# Altium project AMC_BOX_Panel.PrjPCB (part 1 of 2)
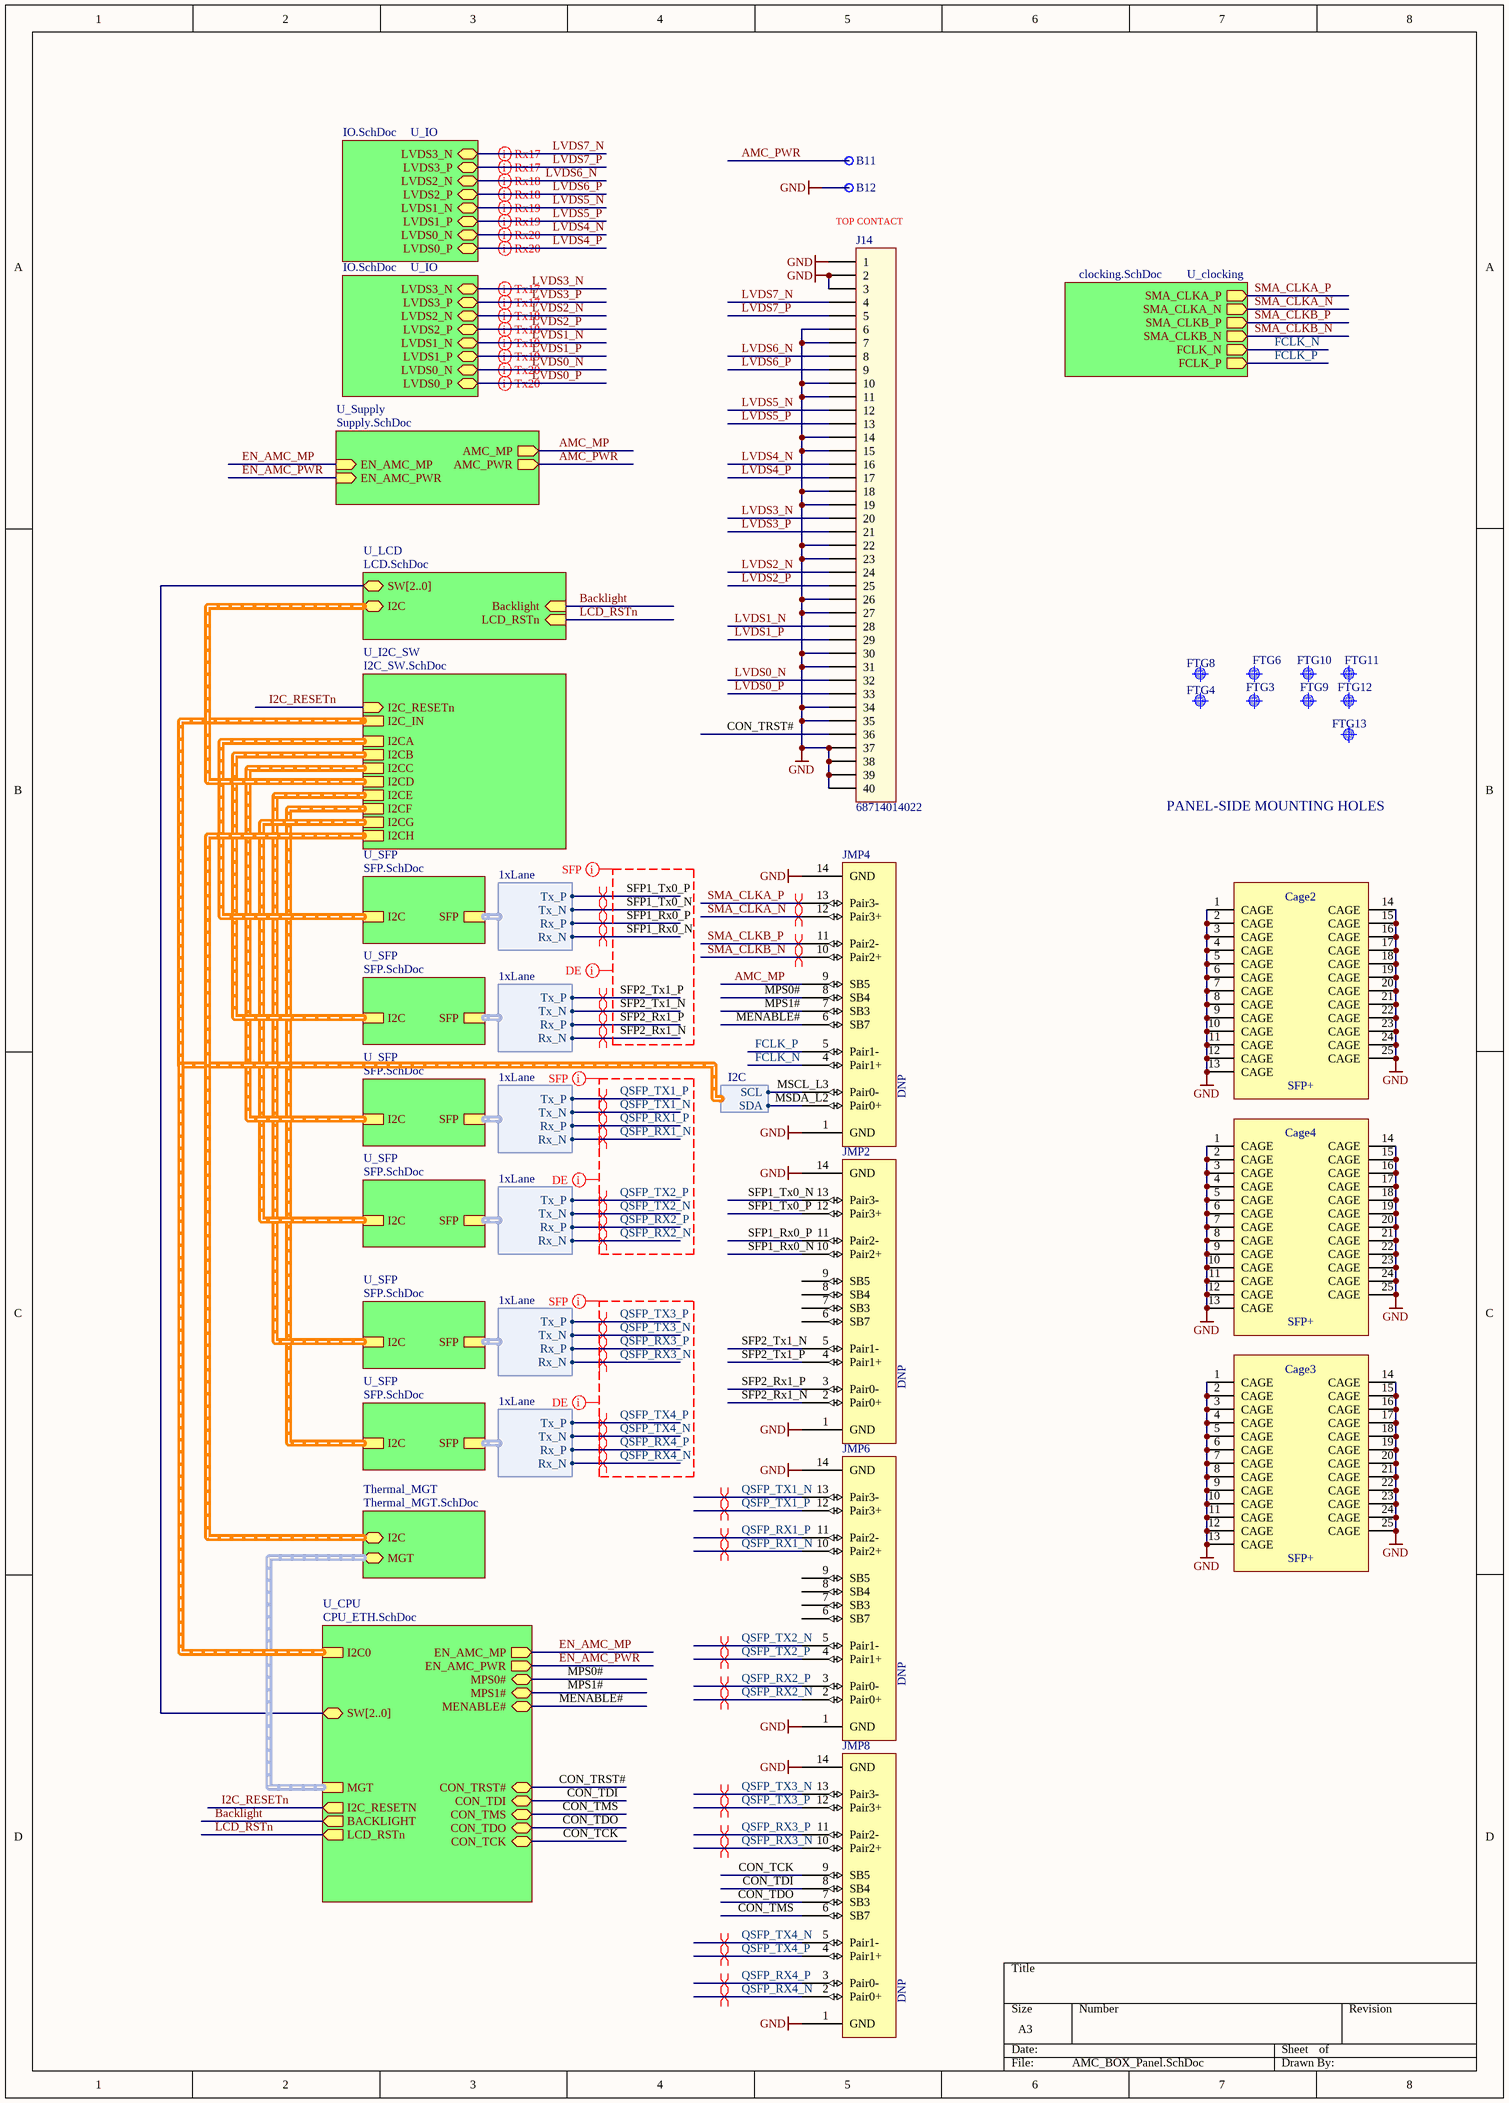
[diagram p0: AMC_BOX_Panel.SchDoc]
9 sheets, 417 parts. Net scope: hierarchical (ports join the sheet entries above them; power ports are global).
Board file: AMC_Single_Panel.PcbDoc
Sheets:
  AMC_BOX_Panel.SchDoc
    U_Supply = Supply.SchDoc
    U_SFP = SFP.SchDoc
    U_SFP = SFP.SchDoc
    U_clocking = clocking.SchDoc
    U_IO = IO.SchDoc
    U_SFP = SFP.SchDoc
    U_SFP = SFP.SchDoc
    U_SFP = SFP.SchDoc
    U_SFP = SFP.SchDoc
    U_I2C_SW = I2C_SW.SchDoc
    Thermal_MGT = Thermal_MGT.SchDoc
    U_CPU = CPU_ETH.SchDoc
    U_LCD = LCD.SchDoc
    U_IO = IO.SchDoc

## Sheet AMC_BOX_Panel.SchDoc
size A3 portrait

### Parts
B11  Plated Hole  [c200h150]  (value not drawn)
B12  Plated Hole  [c200h150]  (value not drawn)
Cage2  SFP+  [TYCO_2007263-1]
Cage3  SFP+  [TYCO_2007263-1]
Cage4  SFP+  [TYCO_2007263-1]
FTG3  Use only in PCB  [FIDUCIAL_TOP_S100-200]  (value not drawn)
FTG4  Use only in PCB  [FIDUCIAL_TOP_S100-200]  (value not drawn)
FTG6  Use only in PCB  [FIDUCIAL_TOP_S100-200]  (value not drawn)
FTG8  Use only in PCB  [FIDUCIAL_TOP_S100-200]  (value not drawn)
FTG9  Use only in PCB  [FIDUCIAL_TOP_S100-200]  (value not drawn)
FTG10  Use only in PCB  [FIDUCIAL_TOP_S100-200]  (value not drawn)
FTG11  Use only in PCB  [FIDUCIAL_TOP_S100-200]  (value not drawn)
FTG12  Use only in PCB  [FIDUCIAL_TOP_S100-200]  (value not drawn)
FTG13  Use only in PCB  [FIDUCIAL_TOP_S100-200]  (value not drawn)
J14  68714014022  [68714014022]
JMP2  DNP  [3M_Twinax_SL8801/12-10DA5-00]
JMP4  DNP  [3M_Twinax_SL8801/12-10DA5-00]
JMP6  DNP  [3M_Twinax_SL8801/12-10DA5-00]
JMP8  DNP  [3M_Twinax_SL8801/12-10DA5-00]

### Sub-sheets
Thermal_MGT = Thermal_MGT.SchDoc: I2C (harness I2C), MGT (harness THERM_MGT)
U_clocking = clocking.SchDoc: SMA_CLKA_P (out), SMA_CLKA_N (out), SMA_CLKB_P (out), SMA_CLKB_N (out), FCLK_N (out), FCLK_P (out)
U_CPU = CPU_ETH.SchDoc: I2C0 (harness I2C), MGT (harness THERM_MGT), EN_AMC_MP (out), EN_AMC_PWR (out), MPS0# (bidir), MPS1# (bidir), MENABLE# (bidir), CON_TRST#, CON_TDI (bidir), CON_TMS (bidir), CON_TDO (bidir), CON_TCK (bidir), SW[2..0] (bidir), BACKLIGHT (out), LCD_RSTn (out), I2C_RESETN (out)
U_I2C_SW = I2C_SW.SchDoc: I2C_RESETn (in), I2CE (harness I2C), I2CB (harness I2C), I2CA (harness I2C), I2CD (harness I2C), I2CC (harness I2C), I2CG (harness I2C), I2CF (harness I2C), I2CH (harness I2C), I2C_IN (harness I2C)
U_IO = IO.SchDoc: LVDS3_N (bidir), LVDS3_P (bidir), LVDS2_N (bidir), LVDS2_P (bidir), LVDS1_N (bidir), LVDS1_P (bidir), LVDS0_N (bidir), LVDS0_P (bidir)
U_IO = IO.SchDoc: LVDS3_N (bidir), LVDS3_P (bidir), LVDS2_N (bidir), LVDS2_P (bidir), LVDS1_N (bidir), LVDS1_P (bidir), LVDS0_N (bidir), LVDS0_P (bidir)
U_LCD = LCD.SchDoc: I2C, Backlight (in), LCD_RSTn (in), SW[2..0] (bidir)
U_SFP = SFP.SchDoc: I2C (harness I2C), SFP (harness 1xLane)
U_SFP = SFP.SchDoc: I2C (harness I2C), SFP (harness 1xLane)
U_SFP = SFP.SchDoc: I2C (harness I2C), SFP (harness 1xLane)
U_SFP = SFP.SchDoc: I2C (harness I2C), SFP (harness 1xLane)
U_SFP = SFP.SchDoc: I2C (harness I2C), SFP (harness 1xLane)
U_SFP = SFP.SchDoc: I2C (harness I2C), SFP (harness 1xLane)
U_Supply = Supply.SchDoc: AMC_PWR (out), AMC_MP (out), EN_AMC_MP (in), EN_AMC_PWR (in)

### Harnesses
1xLane: Rx_P, Rx_N, Tx_P, Tx_N
I2C: SCL, SDA

### Nets
GND: B12.1 Cage2.1(CAGE) Cage2.2(CAGE) Cage2.3(CAGE) Cage2.4(CAGE) Cage2.5(CAGE) Cage2.6(CAGE) Cage2.7(CAGE) Cage2.8(CAGE) Cage2.9(CAGE) Cage2.10(CAGE) Cage2.11(CAGE) Cage2.12(CAGE) Cage2.13(CAGE) Cage2.14(CAGE) Cage2.15(CAGE) Cage2.16(CAGE) Cage2.17(CAGE) Cage2.18(CAGE) Cage2.19(CAGE) Cage2.20(CAGE) Cage2.21(CAGE) Cage2.22(CAGE) Cage2.23(CAGE) Cage2.24(CAGE) Cage2.25(CAGE) Cage3.1(CAGE) Cage3.2(CAGE) Cage3.3(CAGE) Cage3.4(CAGE) Cage3.5(CAGE) Cage3.6(CAGE) Cage3.7(CAGE) Cage3.8(CAGE) Cage3.9(CAGE) Cage3.10(CAGE) Cage3.11(CAGE) Cage3.12(CAGE) Cage3.13(CAGE) Cage3.14(CAGE) Cage3.15(CAGE) Cage3.16(CAGE) Cage3.17(CAGE) Cage3.18(CAGE) Cage3.19(CAGE) Cage3.20(CAGE) Cage3.21(CAGE) Cage3.22(CAGE) Cage3.23(CAGE) Cage3.24(CAGE) Cage3.25(CAGE) Cage4.1(CAGE) Cage4.2(CAGE) Cage4.3(CAGE) Cage4.4(CAGE) Cage4.5(CAGE) Cage4.6(CAGE) Cage4.7(CAGE) Cage4.8(CAGE) Cage4.9(CAGE) Cage4.10(CAGE) Cage4.11(CAGE) Cage4.12(CAGE) Cage4.13(CAGE) Cage4.14(CAGE) Cage4.15(CAGE) Cage4.16(CAGE) Cage4.17(CAGE) Cage4.18(CAGE) Cage4.19(CAGE) Cage4.20(CAGE) Cage4.21(CAGE) Cage4.22(CAGE) Cage4.23(CAGE) Cage4.24(CAGE) Cage4.25(CAGE) J14.1 J14.2 J14.3 J14.6 J14.7 J14.10 J14.11 J14.14 J14.15 J14.18 J14.19 J14.22 J14.23 J14.26 J14.27 J14.30 J14.31 J14.34 J14.35 J14.37 J14.38 J14.39 J14.40 JMP2.1(GND) JMP2.14(GND) JMP4.1(GND) JMP4.14(GND) JMP6.1(GND) JMP6.14(GND) JMP8.1(GND) JMP8.14(GND)
AMC_MP: JMP4.9(SB5) ; sheet U_Supply/AMC_MP
AMC_PWR: B11.1 ; sheet U_Supply/AMC_PWR
Backlight: sheet U_CPU/BACKLIGHT, sheet U_LCD/Backlight
CON_TCK: JMP8.9(SB5) ; sheet U_CPU/CON_TCK
CON_TDI: JMP8.8(SB4) ; sheet U_CPU/CON_TDI
CON_TDO: JMP8.7(SB3) ; sheet U_CPU/CON_TDO
CON_TMS: JMP8.6(SB7) ; sheet U_CPU/CON_TMS
CON_TRST#: J14.36 ; sheet U_CPU/CON_TRST#
EN_AMC_MP: sheet U_Supply/EN_AMC_MP, sheet U_CPU/EN_AMC_MP
EN_AMC_PWR: sheet U_Supply/EN_AMC_PWR, sheet U_CPU/EN_AMC_PWR
FCLK_N: JMP4.4(Pair1+) ; sheet U_clocking/FCLK_N  [project net CLK0_P]
FCLK_P: JMP4.5(Pair1-) ; sheet U_clocking/FCLK_P  [project net CLK0_N]
I2C_RESETn: sheet U_I2C_SW/I2C_RESETn, sheet U_CPU/I2C_RESETN
LCD_RSTn: sheet U_CPU/LCD_RSTn, sheet U_LCD/LCD_RSTn
LVDS0_N: J14.32 ; sheet U_IO/LVDS0_N
LVDS0_P: J14.33 ; sheet U_IO/LVDS0_P
LVDS1_N: J14.28 ; sheet U_IO/LVDS1_N
LVDS1_P: J14.29 ; sheet U_IO/LVDS1_P
LVDS2_N: J14.24 ; sheet U_IO/LVDS2_N
LVDS2_P: J14.25 ; sheet U_IO/LVDS2_P
LVDS3_N: J14.20 ; sheet U_IO/LVDS3_N
LVDS3_P: J14.21 ; sheet U_IO/LVDS3_P
LVDS4_N: J14.16 ; sheet U_IO/LVDS0_N  [project net LVDS0_N]
LVDS4_P: J14.17 ; sheet U_IO/LVDS0_P  [project net LVDS0_P]
LVDS5_N: J14.12 ; sheet U_IO/LVDS1_N  [project net LVDS1_N]
LVDS5_P: J14.13 ; sheet U_IO/LVDS1_P  [project net LVDS1_P]
LVDS6_N: J14.8 ; sheet U_IO/LVDS2_N  [project net LVDS2_N]
LVDS6_P: J14.9 ; sheet U_IO/LVDS2_P  [project net LVDS2_P]
LVDS7_N: J14.4 ; sheet U_IO/LVDS3_N  [project net LVDS3_N]
LVDS7_P: J14.5 ; sheet U_IO/LVDS3_P  [project net LVDS3_P]
MENABLE#: JMP4.6(SB7) ; sheet U_CPU/MENABLE#
MPS0#: JMP4.8(SB4) ; sheet U_CPU/MPS0#
MPS1#: JMP4.7(SB3) ; sheet U_CPU/MPS1#
MSCL_L: JMP4.3(Pair0-) ; sheet U_I2C_SW/I2C_IN.SCL
MSDA_L: JMP4.2(Pair0+) ; sheet U_I2C_SW/I2C_IN.SDA
QSFP_RX1_N: JMP6.10(Pair2+) ; sheet U_SFP/SFP.Rx_N
QSFP_RX1_P: JMP6.11(Pair2-) ; sheet U_SFP/SFP.Rx_P
QSFP_RX2_N: JMP6.2(Pair0+) ; sheet U_SFP/SFP.Rx_N
QSFP_RX2_P: JMP6.3(Pair0-) ; sheet U_SFP/SFP.Rx_P
QSFP_RX3_N: JMP8.10(Pair2+) ; sheet U_SFP/SFP.Rx_N
QSFP_RX3_P: JMP8.11(Pair2-) ; sheet U_SFP/SFP.Rx_P
QSFP_RX4_N: JMP8.2(Pair0+) ; sheet U_SFP/SFP.Rx_N
QSFP_RX4_P: JMP8.3(Pair0-) ; sheet U_SFP/SFP.Rx_P
QSFP_TX1_N: JMP6.13(Pair3-) ; sheet U_SFP/SFP.Tx_N
QSFP_TX1_P: JMP6.12(Pair3+) ; sheet U_SFP/SFP.Tx_P
QSFP_TX2_N: JMP6.5(Pair1-) ; sheet U_SFP/SFP.Tx_N
QSFP_TX2_P: JMP6.4(Pair1+) ; sheet U_SFP/SFP.Tx_P
QSFP_TX3_N: JMP8.13(Pair3-) ; sheet U_SFP/SFP.Tx_N
QSFP_TX3_P: JMP8.12(Pair3+) ; sheet U_SFP/SFP.Tx_P
QSFP_TX4_N: JMP8.5(Pair1-) ; sheet U_SFP/SFP.Tx_N
QSFP_TX4_P: JMP8.4(Pair1+) ; sheet U_SFP/SFP.Tx_P
SFP1_Rx0_N: JMP2.10(Pair2+) ; sheet U_SFP/SFP.Rx_N  [project net RX_N]
SFP1_Rx0_P: JMP2.11(Pair2-) ; sheet U_SFP/SFP.Rx_P  [project net RX_P]
SFP1_Tx0_N: JMP2.13(Pair3-) ; sheet U_SFP/SFP.Tx_N
SFP1_Tx0_P: JMP2.12(Pair3+) ; sheet U_SFP/SFP.Tx_P
SFP2_Rx1_N: JMP2.2(Pair0+) ; sheet U_SFP/SFP.Rx_N  [project net RX_N]
SFP2_Rx1_P: JMP2.3(Pair0-) ; sheet U_SFP/SFP.Rx_P  [project net RX_P]
SFP2_Tx1_N: JMP2.5(Pair1-) ; sheet U_SFP/SFP.Tx_N
SFP2_Tx1_P: JMP2.4(Pair1+) ; sheet U_SFP/SFP.Tx_P
SMA_CLKA_N: JMP4.12(Pair3+) ; sheet U_clocking/SMA_CLKA_N
SMA_CLKA_P: JMP4.13(Pair3-) ; sheet U_clocking/SMA_CLKA_P
SMA_CLKB_N: JMP4.10(Pair2+) ; sheet U_clocking/SMA_CLKB_N
SMA_CLKB_P: JMP4.11(Pair2-) ; sheet U_clocking/SMA_CLKB_P

Not connected (* = marked no-connect by the designer): JMP2 6(SB7) 7(SB3) 8(SB4) 9(SB5); JMP6 6(SB7) 7(SB3) 8(SB4) 9(SB5)

### Buses and harness runs
bus sheet U_CPU/SW[2..0] = sheet U_LCD/SW[2..0]
harness sheet Thermal_MGT/I2C = sheet U_I2C_SW/I2CH
harness sheet Thermal_MGT/MGT = sheet U_CPU/MGT
harness sheet U_CPU/I2C0 = sheet U_I2C_SW/I2C_IN
harness sheet U_I2C_SW/I2CA = sheet U_SFP/I2C
harness sheet U_I2C_SW/I2CB = sheet U_SFP/I2C
harness sheet U_I2C_SW/I2CC = sheet U_SFP/I2C
harness sheet U_I2C_SW/I2CD = sheet U_LCD/I2C
harness sheet U_I2C_SW/I2CE = sheet U_SFP/I2C
harness sheet U_I2C_SW/I2CF = sheet U_SFP/I2C
harness sheet U_I2C_SW/I2CG = sheet U_SFP/I2C

### Layout directives
differential pair: LVDS0_N, LVDS0_P, LVDS1_N, LVDS1_P, LVDS2_N, LVDS2_P, LVDS3_N, LVDS3_P, QSFP_RX1_N, QSFP_RX1_P, QSFP_RX2_N, QSFP_RX2_P, QSFP_RX3_N, QSFP_RX3_P, QSFP_RX4_N, QSFP_RX4_P, QSFP_TX1_N, QSFP_TX1_P, QSFP_TX2_N, QSFP_TX2_P, QSFP_TX3_N, QSFP_TX3_P, QSFP_TX4_N, QSFP_TX4_P, RX_N, RX_P, SFP1_Tx0_N, SFP1_Tx0_P, SFP2_Tx1_N, SFP2_Tx1_P, SMA_CLKA_N, SMA_CLKA_P, SMA_CLKB_N, SMA_CLKB_P
net class SFP: QSFP_RX1_N, QSFP_RX1_P, QSFP_RX2_N, QSFP_RX2_P, QSFP_RX3_N, QSFP_RX3_P, QSFP_RX4_N, QSFP_RX4_P, QSFP_TX1_N, QSFP_TX1_P, QSFP_TX2_N, QSFP_TX2_P, QSFP_TX3_N, QSFP_TX3_P, QSFP_TX4_N, QSFP_TX4_P, SFP1_Rx0_N, SFP1_Rx0_P, SFP1_Tx0_N, SFP1_Tx0_P, SFP2_Rx1_N, SFP2_Rx1_P, SFP2_Tx1_N, SFP2_Tx1_P
net class DE: QSFP_RX1_N, QSFP_RX1_P, QSFP_RX2_N, QSFP_RX2_P, QSFP_RX3_N, QSFP_RX3_P, QSFP_RX4_N, QSFP_RX4_P, QSFP_TX1_N, QSFP_TX1_P, QSFP_TX2_N, QSFP_TX2_P, QSFP_TX3_N, QSFP_TX3_P, QSFP_TX4_N, QSFP_TX4_P, SFP1_Rx0_N, SFP1_Rx0_P, SFP1_Tx0_N, SFP1_Tx0_P, SFP2_Rx1_N, SFP2_Rx1_P, SFP2_Tx1_N, SFP2_Tx1_P

### Notes on the sheet
- TOP CONTACT
- PANEL-SIDE MOUNTING HOLES

### Library data of the parts
B11 B12 = PLATED_HOLE1.5_PAD2.0: Single Terminal Socket; Part Description: Plated Through Hole: Hole Dia.=1.5mm Pad Dia.=2.0mm, IPC-7251 Level C; Mounted: No; Part Number: PLATED_HOLE1.5_PAD2.0; Component Kind: Standard (No BOM); Component Type: Standard (No BOM); Pin Count: 1; Family: Plated Hole; Socket: No; SMD: No; Sense: No; Status: None; ComponentHeight: 0mm; HelpURL: Undefined; Author: CERN DEM JLC; CreateDate: 30.10.2008; LatestRevisionDate: 30.10.2008; PackageDescription: Plated Through Hole: Hole Dia.=1.5mm Pad Dia.=2.0mm, IPC-7251 Level C
Cage2-Cage4 = TYCO_2007263-1: SFP 1x2 Cage (25Pins); Part Description: 1x2 Press Fit SFP+ Cage with EMI Springs; Manufacturer: TYCO ELECTRONICS; Part Number: TYCO_2007263-1; Component Kind: Standard; Component Type: Standard; Pin Count: 25; Family: SFP+; Mounted: Yes; Socket: No; SMD: No; PressFit: Yes; Sense: No; Status: None; Manufacturer Part Number: 2007263-1; ComponentHeight: 9.7mm; HelpURL: \\cern.ch\dfs\Applications\Altium\Datasheets\TYCO_2007263-1.pdf; Author: CERN DEM JLC; CreateDate: 18.01.2017; LatestRevisionDate: 18.01.2017
FTG3 FTG4 FTG6 FTG8-FTG13 = FIDUCIAL_TARGET_S100-200: Fiducial Target; Part Description: Square Fiducial Target, Top Layer, 1.0mm, Top Solder 2.0mm, Keepout =2.0mm; Mounted: No; Table: Pads; Part Number: FIDUCIAL_TARGET_S100-200; Component Kind: Standard (No BOM); Component Type: Standard (No BOM); Pin Count: 1; Family: Fiducial; Socket: No; SMD: Yes; Status: None; ComponentHeight: 0mm; Author: CERN DEM JLC; CreateDate: 2010-02-09; LatestRevisionDate: 2012-04-04; PackageDescription: Square Fiducial Target, Top Layer, 1.0mm, Top Solder 2.0mm, Keepout =2.0mm
J14 = 68714014022: 0.50 mm SMT ZIF Horizontal Top Contact WR-FPC, 40 pins; Pitch: 0.5 mm; Pin Number: 40; ComponentLink1Description: Manufacturer; ComponentLink1URL: http://www.we-online.de; ComponentLink2Description: Datasheet; ComponentLink2URL: http://katalog.we-online.com/em/datasheet/6871xx14022.pdf; Part Number: 68714014022; Published Date: April 2017; Publisher: Wurth Elektronik
JMP2 JMP4 JMP6 JMP8 = CBL_TWINAX_3M_4pairs_SB: Flat Ribbon Cable Silver 8 (4 Pair) Conductors 0.093" (2.37mm) Between Pairs Flat Twin Axial 500.0' (152.40m)

## Sheet Supply.SchDoc
size A4
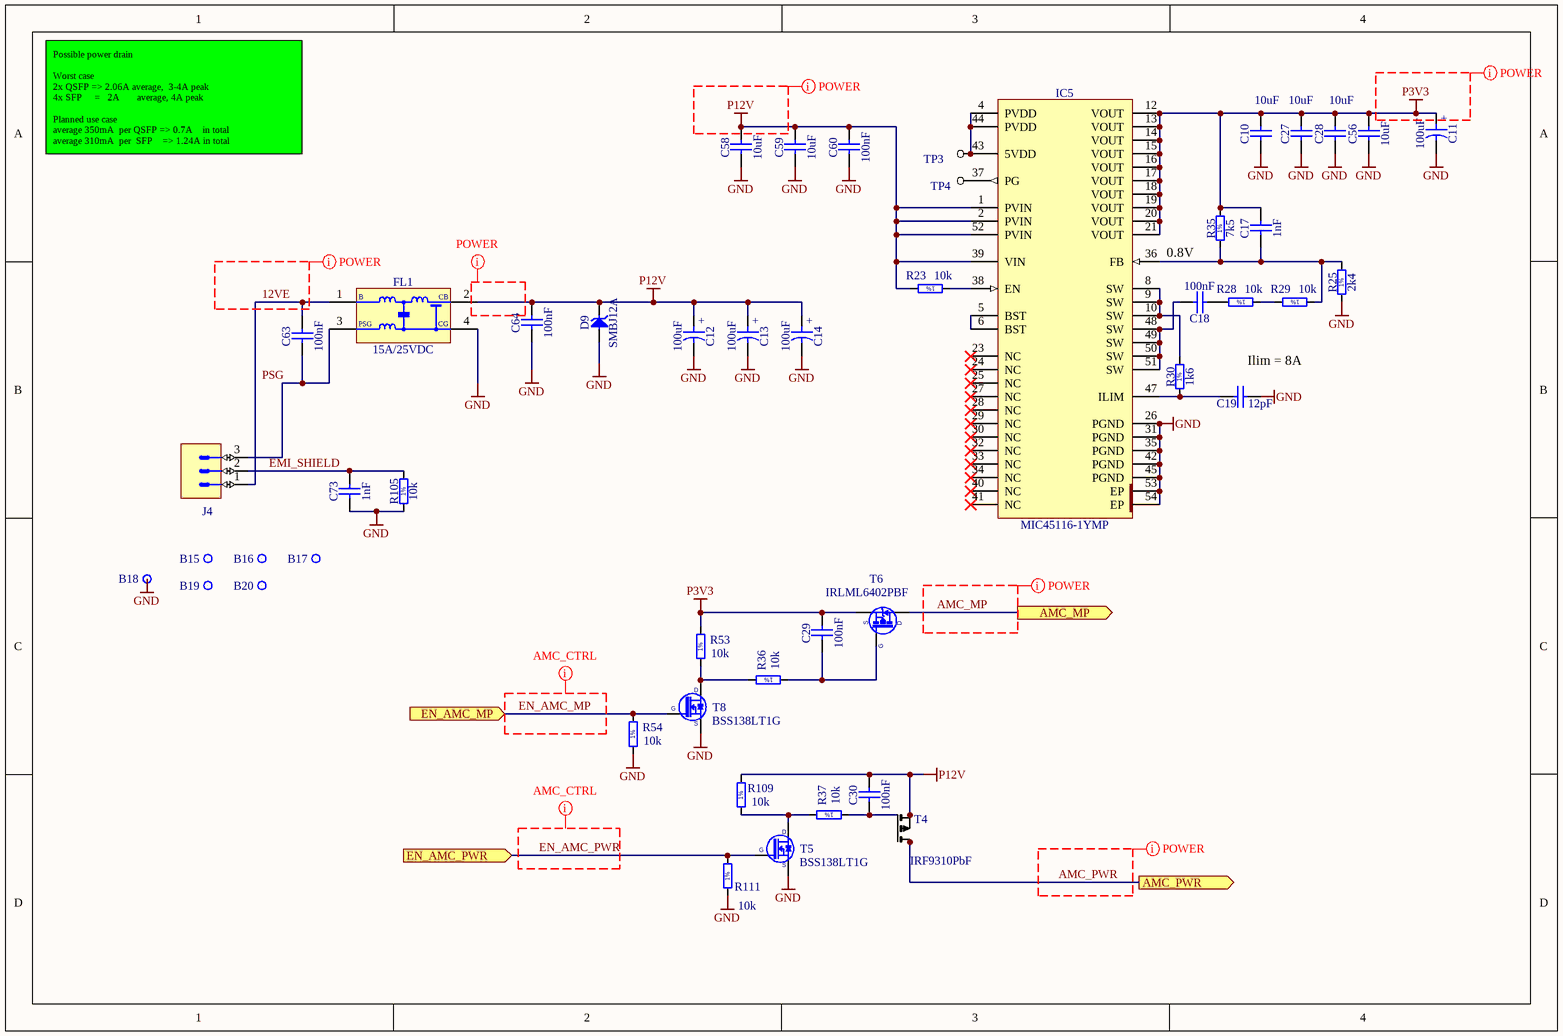
[diagram p1: Supply.SchDoc]

### Parts
B15  Plated Hole  [MTG320_550]  (value not drawn)
B16  Plated Hole  [MTG320_550]  (value not drawn)
B17  Plated Hole  [MTG320_550]  (value not drawn)
B18  Plated Hole  [MTG320_550]  (value not drawn)
B19  Plated Hole  [MTG320_550]  (value not drawn)
B20  Plated Hole  [MTG320_550]  (value not drawn)
C10  10uF  [CAPC2012X135N]
C11  100uF  [CAPAE660X540N]
C12  100uF  [CAPAE660X540N]
C13  100uF  [CAPAE660X540N]
C14  100uF  [CAPAE660X540N]
C17  1nF  [CAPC1005X55N]
C18  100nF  [CAPC1005X55N]
C19  12pF  [CAPC1005X55N]
C27  10uF  [CAPC2012X135N]
C28  10uF  [CAPC2012X135N]
C29  100nF  [CAPC1005X55N]
C30  100nF  [CAPC1005X55N]
C56  10uF  [CAPC2012X135N]
C58  10uF  [CAPC3216X140N]
C59  10uF  [CAPC3216X140N]
C60  100nF  [CAPC1005X55N]
C63  100nF  [CAPC1005X55N]
C64  100nF  [CAPC1005X55N]
C73  1nF  [CAPC1005X55N]
D9  SMBJ12A  [DIOM5336X265N]
FL1  15A/25VDC  [FIL_MURATA_BNX016]
IC5  MIC45116-1YMP  [MICROCHIP_H3QFN88-52LD-PL-3]
J4  (no value)  [PHOENIX_1755749]
R23  10k  [RESC1005X40N]
R25  2k4  [RESC1005X40N]
R28  10k  [RESC1005X40N]
R29  10k  [RESC1005X40N]
R30  1k6  [RESC1005X40N]
R35  7k5  [RESC1005X40N]
R36  10k  [RESC1005X40N]
R37  10k  [RESC1005X40N]
R53  10k  [RESC1005X40N]
R54  10k  [RESC1005X40N]
R105  10k  [RESC1005X40N]
R109  10k  [RESC1005X40N]
R111  10k  [RESC1005X40N]
T4  IRF9310PbF  [so-8]
T5  BSS138LT1G  [SOT95P240X110-3N]
T6  IRLML6402PBF  [SOT95P237X112-3N]
T8  BSS138LT1G  [SOT95P240X110-3N]
TP3  TP  [TP]  (value not drawn)
TP4  TP  [TP]  (value not drawn)

### Ports
AMC_MP (out), AMC_PWR (out), EN_AMC_MP (in), EN_AMC_PWR (in)

### Nets
GND: B18.1 C10.1 C11.2 C12.2 C13.2 C14.2 C19.1 C27.1 C28.1 C56.1 C58.1 C59.1 C60.1 C64.1 C73.1 D9.2(A) FL1.4(CG) IC5.26(PGND) IC5.31(PGND) IC5.35(PGND) IC5.42(PGND) IC5.45(PGND) IC5.53(EP) IC5.54(EP) R25.1 R54.1 R105.1 R111.1 T5.2(S) T8.2(S)
P3V3: C10.2 C11.1 C17.2 C27.2 C28.2 C29.2 C56.2 IC5.12(VOUT) IC5.13(VOUT) IC5.14(VOUT) IC5.15(VOUT) IC5.16(VOUT) IC5.17(VOUT) IC5.18(VOUT) IC5.19(VOUT) IC5.20(VOUT) IC5.21(VOUT) R35.2 R53.2 T6.2(S)
P12V: C12.1 C13.1 C14.1 C30.2 C58.2 C59.2 C60.2 C64.2 D9.1(C) FL1.2(CB) IC5.1(PVIN) IC5.2(PVIN) IC5.39(VIN) IC5.52(PVIN) R23.2 R109.2 T4.1(S1) T4.2(S1) T4.3(S1)
12VE: C63.2 FL1.1(B) J4.1
AMC_MP: T6.3(D) ; port AMC_MP
AMC_PWR: T4.5(D1) T4.6(D1) T4.7(D1) T4.8(D1) ; port AMC_PWR
EMI_SHIELD: C73.2 J4.2 R105.2
EN_AMC_MP: R54.2 T8.1(G) ; port EN_AMC_MP
EN_AMC_PWR: R111.2 T5.1(G) ; port EN_AMC_PWR
NetC17_1: C17.1 IC5.36(FB) R25.2 R29.1 R35.1
NetC18_1: C18.1 R28.2
NetC18_2: C18.2 IC5.48(SW) IC5.49(SW) IC5.50(SW) IC5.51(SW)
NetC19_2: C19.2 IC5.47(ILIM) R30.1
NetC29_1: C29.1 R36.1 T6.1(G)
NetC30_1: C30.1 R37.1 T4.4(G1)
NetC63_1: C63.1 FL1.3(PSG) J4.3
NetIC5_4: IC5.4(PVDD) IC5.43(5VDD) IC5.44(PVDD) TP3.1
NetIC5_5: IC5.5(BST) IC5.6(BST)
NetIC5_8: IC5.8(SW) IC5.9(SW) IC5.10(SW) R30.2
NetIC5_37: IC5.37(PG) TP4.1
NetIC5_38: IC5.38(EN) R23.1
NetR28_1: R28.1 R29.2
NetR36_2: R36.2 R53.1 T8.3(D)
NetR37_2: R37.2 R109.1 T5.3(D)

Not connected (* = marked no-connect by the designer): B15 1; B16 1; B17 1; B19 1; B20 1; IC5 23(NC)* 24(NC)* 25(NC)* 27(NC)* 28(NC)* 29(NC)* 30(NC)* 32(NC)* 33(NC)* 34(NC)* 40(NC)* 41(NC)*

### Layout directives
net class POWER: 12VE, (no net found under the mark), AMC_MP, AMC_PWR, P3V3, P12V
net class AMC_CTRL: EN_AMC_MP, EN_AMC_PWR

### Notes on the sheet
- Possible power drain
  Worst case
  2x QSFP => 2.06A average,  3-4A peak
  4x SFP     =   2A       average, 4A peak
  Planned use case
  average 350mA  per QSFP => 0.7A    in total
  average 310mA  per  SFP    => 1.24A in total
- 0.8V
- (near C19) Ilim = 8A
- Labels drawn without touching a wire or pin: PSG
- (in symbol CAE660-540_100UF_16V_20%) +
- (in symbol R0402_1K6_1%_0.0625W_100PPM) 1%
- (in symbol R0402_2K4_1%_0.0625W_100PPM) 1%
- (in symbol R0402_7K5_1%_0.0625W_100PPM) 1%
- (in symbol R0402_10K_1%_0.0625W_100PPM) 1%

### Library data of the parts
B15-B20 = PLATED_HOLE3.2_PAD5.5: Single Terminal Socket; Part Description: Plated Through Hole: Hole Dia.=3.2mm Pad Dia.=5.5mm; Mounted: No; Part Number: PLATED_HOLE3.2_PAD5.5; Component Kind: Standard (No BOM); Component Type: Standard (No BOM); Pin Count: 1; Family: Plated Hole; Socket: No; SMD: No; Sense: No; Status: None; ComponentHeight: 0mm; HelpURL: Undefined; Author: CERN DEM JMW; CreateDate: 01.10.2012; LatestRevisionDate: 01.10.2012; PackageDescription: Plated Through Hole: Hole Dia.=3.2mm Pad Dia.=5.5mm
C10 C27 C28 C56 = CC0805_10UF_10V_10%_X7R: Non-polarised capacitor; Part Description: SMD Multilayer Chip Ceramic Capacitor; Manufacturer: GENERIC; Manufacturer1 Part Number: GRM21BR71A106KE51L; Voltage: 10V; TC: X7R; Tolerance: ±10%; Table: Capacitors SMD; Part Number: CC0805_10UF_10V_10%_X7R; Component Kind: Standard; Component Type: Standard; Pin Count: 2; Value: 10uF; Status: Preferred; Manufacturer Part Number: CC0805_10UF_10V_10%_X7R; Case: 0805; Mounted: Yes; Socket: No; SMD: Yes; Manufacturer1 Example: MURATA; Manufacturer1 ComponentHeight: 1.35mm; HelpURL: \\cern.ch\dfs\Applications\Altium\Datasheets\CC0805_X7R_MURATA.pdf; Author: CERN DEM JLC; CreateDate: 2012-04-30; LatestRevisionDate: 2012-04-30
C11-C14 = CAE660-540_100UF_16V_20%: Polarised capacitor; Part Description: Aluminum Electrolytic SMT Capacitor; Manufacturer: PANASONIC; Manufacturer Part Number: EEEFK1C101AP; Voltage: 16V; Tolerance: ±20%; Part Number: CAE660-540_100UF_16V_20%; Component Kind: Standard; Component Type: Standard; Pin Count: 2; Value: 100uF; Status: Not Recommended; Case: D; Mounted: Yes; Socket: No; SMD: Yes; Sense: No; ComponentHeight: 5.8mm; HelpURL: \\cern.ch\dfs\Applications\Altium\Datasheets\CAE_PANASONIC_FK.pdf; Author: CERN DEM JLC; CreateDate: 03.12.2007; LatestRevisionDate: 05.11.2014
C17 C73 = CC0402_1NF_50V_10%_X7R: Non-polarised capacitor; Part Description: SMD Multilayer Chip Ceramic Capacitor; Manufacturer: GENERIC; Manufacturer1 Part Number: 223858715623; Voltage: 50V; TC: X7R; Tolerance: ±10%; Part Number: CC0402_1NF_50V_10%_X7R; Component Kind: Standard; Component Type: Standard; Pin Count: 2; Value: 1nF; Status: Not Recommended; Manufacturer Part Number: CC0402_1NF_50V_10%_X7R; Case: 0402; Mounted: Yes; Socket: No; SMD: Yes; Sense: No; Manufacturer1 Example: PHYCOMP; Manufacturer1 ComponentHeight: 0.55mm; HelpURL: \\cern.ch\dfs\Applications\Altium\Datasheets\CC0402_X7R_PHYCOMP.pdf; Author: CERN DEM JLC; CreateDate: 03.12.2007; LatestRevisionDate: 03.12.2007
C18 C29 C30 C60 C63 C64 = CC0402_100NF_16V_10%_X5R: Non-polarised capacitor; Part Description: SMD Multilayer Chip Ceramic Capacitor; Manufacturer: GENERIC; Manufacturer1 Part Number: GRM155R61C104KA88D; Voltage: 16V; TC: X5R; Tolerance: ±10%; Table: Capacitors SMD; Part Number: CC0402_100NF_16V_10%_X5R; Component Kind: Standard; Component Type: Standard; Pin Count: 2; Value: 100nF; Status: None; Manufacturer Part Number: CC0402_100NF_16V_10%_X5R; Case: 0402; Mounted: Yes; Socket: No; SMD: Yes; Manufacturer1 Example: MURATA; Manufacturer1 ComponentHeight: 0.55mm; HelpURL: \\cern.ch\dfs\Applications\Altium\Datasheets\CC0402_X5R_MURATA_GRM.pdf; Author: CERN DEM JLC; CreateDate: 2013-12-10; LatestRevisionDate: 2013-12-10
C19 = CC0402_12PF_50V_5%_C0G: Non-polarised capacitor; Part Description: SMD Multilayer Chip Ceramic Capacitor; Manufacturer: GENERIC; Manufacturer1 Part Number: C0402C120J5GACTU; Voltage: 50V; TC: C0G/NP0; Tolerance: ±5%; Part Number: CC0402_12PF_50V_5%_C0G; Component Kind: Standard; Component Type: Standard; Pin Count: 2; Value: 12pF; Status: Preferred; Manufacturer Part Number: CC0402_12PF_50V_5%_C0G; Case: 0402; Mounted: Yes; Socket: No; SMD: Yes; Sense: No; Manufacturer1 Example: KEMET; Manufacturer1 ComponentHeight: 0.55mm; HelpURL: \\cern.ch\dfs\Applications\Altium\Datasheets\CC0805_C0G_KEMET_(Commercial Grade).pdf; Author: CERN DEM JLC; CreateDate: 04.10.2016; LatestRevisionDate: 04.10.2016
C58 C59 = CC1206_10UF_16V_10%_X7R: Non-polarised capacitor; Part Description: SMD Multilayer Chip Ceramic Capacitor; Manufacturer: GENERIC; Manufacturer1 Part Number: C1206C106K4RAC; Voltage: 16V; TC: X7R; Tolerance: ±10%; Table: Capacitors SMD; Part Number: CC1206_10UF_16V_10%_X7R; Component Kind: Standard; Component Type: Standard; Pin Count: 2; Value: 10uF; Status: Preferred; Manufacturer Part Number: CC1206_10uF_16V_10%_X7R; Case: 1206; Mounted: Yes; Socket: No; SMD: Yes; Manufacturer1 Example: KEMET; Manufacturer1 ComponentHeight: 1.8mm; HelpURL: \\cern.ch\dfs\Applications\Altium\Datasheets\CC1206_X7R_KEMET.pdf; Author: CERN DEM JLC; CreateDate: 2009-04-28; LatestRevisionDate: 2009-04-28
D9 = SMBJ12A: Zener Diode; Part Description: Uni-Directional Transient Voltage Suppressor Diode; Manufacturer: FAIRCHILD SEMICONDUCTOR; Voltage: 12V; Power: 600W; PressFit: No; Bonding: No; Part Number: SMBJ12A; Component Kind: Standard; Component Type: Standard; Device: SMBJ12A; PackageDescription: DO-214-AA/SMB Diode, Molded Body; 5.34mm L X 3.625mm W X 2.65mm H, IPC Medium Density; Manufacturer Part Number: SMBJ12A; Pin Count: 2; Case: DO-214AA; Mounted: Yes; Socket: No; SMD: Yes; Sense: No; ComponentHeight: 2.65mm; HelpURL: \\cern.ch\dfs\Applications\Altium\Datasheets\SMBJ.pdf; Author: CERN DEM JLC; CreateDate: 10.04.2013; LatestRevisionDate: 10.04.2013
FL1 = FIL_MURATA_BNX016-01: Block Type EMIFIL (LC Combined) SMD Type, BNX01* Serie; Part Description: Block Type EMIFIL (LC Combined), BNX01* Series; Manufacturer: MURATA; Part Number: FIL_MURATA_BNX016-01; Component Kind: Standard; Component Type: Standard; Pin Count: 6; Value: 15A/25VDC; Manufacturer Part Number: BNX016-01; Mounted: Yes; Socket: No; SMD: No; Sense: No; ComponentHeight: 8.5mm; HelpURL: \\cern.ch\dfs\Applications\Altium\Datasheets\FIL_MURATA_BNX016-01.pdf; Author: CERN DEM JLC; CreateDate: 20.01.2014; LatestRevisionDate: 20.01.2014
IC5 = MIC45116-1YMP: 0.8V to 85% PVIN (4.75-19V), 6A Synchronous Step-Down Regulator Module; Manufacturer: MICROCHIP TECHNOLOGY; PressFit: No; Bonding: No; Part Number: MIC45116-1YMP; Component Kind: Standard; Component Type: Standard; Device: MIC45116-1YMP; PackageDescription: MICROCHIP_H3QFN88-52LD-PL-3, 0.50mm Pitch, Square, 52 Pin, 8mm L X 8mm W X 3mm H Body; Part Description: 0.8V to 85% PVIN (4.75-19V), 6A Synchronous Step-Down Regulator Module; Manufacturer Part Number: MIC45116-1YMP; Pin Count: 53; Mounted: Yes; Socket: No; SMD: Yes; Sense: No; ComponentHeight: 3mm; HelpURL: \\cern.ch\dfs\Applications\Altium\Datasheets\MIC45116-1YMP.pdf; Author: CERN DEM JMW; CreateDate: 15.08.2016; LatestRevisionDate: 15.08.2016
J4 = PHOENIX_1755749: Connector 3 Male; Part Description: 12A, 250V, Pitch 5.08mm, 3 Positions Header; Manufacturer: PHOENIX CONTACT; Manufacturer Part Number: 1755749 (MSTBVA 2,5/3-G-5,08); PressFit: No; Part Number: PHOENIX_1755749; Component Kind: Standard; Component Type: Standard; Pin Count: 3; Mounted: Yes; Socket: No; SMD: No; Sense: No; Status: None; ComponentHeight: 12mm; HelpURL: \\cern.ch\dfs\Applications\Altium\Datasheets\PHOENIX_1755749.pdf; Author: CERN DEM JLC; CreateDate: 13.11.2013; LatestRevisionDate: 13.11.2013
R23 R28 R29 R36 R37 R53 R54 R109 R111 = R0402_10K_1%_0.0625W_100PPM: Resistor - 1%; Part Description: General Purpose Thick Film Chip Resistor; Manufacturer: GENERIC; Manufacturer1 Part Number: 232270671003L; TC: ±100ppm/°C; Table: Resistors SMD; Part Number: R0402_10K_1%_0.0625W_100PPM; Component Kind: Standard; Component Type: Standard; Pin Count: 2; Value: 10k; Status: Not recommended; Power: 0.0625W; Tolerance: ±1%; Manufacturer Part Number: R0402_10K_1%_0.0625W_100PPM; Case: 0402; Mounted: Yes; Socket: No; SMD: Yes; Manufacturer1 Example: YAGEO PHYCOMP; Manufacturer1 ComponentHeight: 0.4mm; HelpURL: \\cern.ch\dfs\Applications\Altium\Datasheets\R0402_Phycomp_RC0402.pdf; Author: CERN DEM JLC; CreateDate: 2007-12-03; LatestRevisionDate: 2012-10-17
R25 = R0402_2K4_1%_0.0625W_100PPM: Resistor - 1%; Part Description: General Purpose Thick Film Chip Resistor; Manufacturer: GENERIC; Manufacturer1 Part Number: 232270672402L; TC: ±100ppm/°C; PressFit: No; Part Number: R0402_2K4_1%_0.0625W_100PPM; Component Kind: Standard; Component Type: Standard; Pin Count: 2; Value: 2k4; Status: Not Recommended; Power: 0.0625W; Tolerance: ±1%; Manufacturer Part Number: R0402_2K4_1%_0.0625W_100PPM; Case: 0402; Mounted: Yes; Sense: No; Socket: No; SMD: Yes; Manufacturer1 Example: YAGEO PHYCOMP; Manufacturer1 ComponentHeight: 0.4mm; HelpURL: \\cern.ch\dfs\Applications\Altium\Datasheets\R0402_Phycomp_RC0402.pdf; Author: CERN DEM JLC; CreateDate: 03.12.2007; LatestRevisionDate: 17.10.2012
R30 = R0402_1K6_1%_0.0625W_100PPM: Resistor - 1%; Part Description: General Purpose Thick Film Chip Resistor; Manufacturer: GENERIC; Manufacturer1 Part Number: 232270671602L; TC: ±100ppm/°C; PressFit: No; Part Number: R0402_1K6_1%_0.0625W_100PPM; Component Kind: Standard; Component Type: Standard; Pin Count: 2; Value: 1k6; Status: Not Recommended; Power: 0.0625W; Tolerance: ±1%; Manufacturer Part Number: R0402_1K6_1%_0.0625W_100PPM; Case: 0402; Mounted: Yes; Sense: No; Socket: No; SMD: Yes; Manufacturer1 Example: YAGEO PHYCOMP; Manufacturer1 ComponentHeight: 0.4mm; HelpURL: \\cern.ch\dfs\Applications\Altium\Datasheets\R0402_Phycomp_RC0402.pdf; Author: CERN DEM JLC; CreateDate: 03.12.2007; LatestRevisionDate: 17.10.2012
R35 = R0402_7K5_1%_0.0625W_100PPM: Resistor - 1%; Part Description: General Purpose Thick Film Chip Resistor; Manufacturer: GENERIC; Manufacturer1 Part Number: 232270677502L; TC: ±100ppm/°C; PressFit: No; Part Number: R0402_7K5_1%_0.0625W_100PPM; Component Kind: Standard; Component Type: Standard; Pin Count: 2; Value: 7k5; Status: Not Recommended; Power: 0.0625W; Tolerance: ±1%; Manufacturer Part Number: R0402_7K5_1%_0.0625W_100PPM; Case: 0402; Mounted: Yes; Sense: No; Socket: No; SMD: Yes; Manufacturer1 Example: YAGEO PHYCOMP; Manufacturer1 ComponentHeight: 0.4mm; HelpURL: \\cern.ch\dfs\Applications\Altium\Datasheets\R0402_Phycomp_RC0402.pdf; Author: CERN DEM JLC; CreateDate: 03.12.2007; LatestRevisionDate: 17.10.2012
R105 = R0402_10K_1%_0.0625W_100PPM: Resistor - 1%; Part Description: General Purpose Thick Film Chip Resistor; Manufacturer: GENERIC; Manufacturer1 Part Number: 232270671003L; TC: ±100ppm/°C; PressFit: No; Part Number: R0402_10K_1%_0.0625W_100PPM; Component Kind: Standard; Component Type: Standard; Pin Count: 2; Value: 10k; Status: Not Recommended; Power: 0.0625W; Tolerance: ±1%; Manufacturer Part Number: R0402_10K_1%_0.0625W_100PPM; Case: 0402; Mounted: Yes; Socket: No; SMD: Yes; Manufacturer1 Example: YAGEO PHYCOMP; Manufacturer1 ComponentHeight: 0.4mm; HelpURL: \\cern.ch\dfs\Applications\Altium\Datasheets\R0402_Phycomp_RC0402.pdf; Author: CERN DEM JLC; CreateDate: 03.12.2007; LatestRevisionDate: 17.10.2012; Sense: No
T4 = Q_IRF9310: PMOS 30V, 4.6mR, 20A, 2.5W
T5 T8 = BSS138LT1G: N-CHANNEL MOSFET WITH DIODE; Part Description: 50V 200mA N-Channel Enhancement Mode Field-Effect Transistor; Manufacturer: ON SEMICONDUCTOR; PressFit: No; Bonding: No; Part Number: BSS138LT1G; Component Kind: Standard; Component Type: Standard; Device: BSS138LT1G; PackageDescription: SOT23 3-Leads, Pitch 0.95mm - Body 1.4x3mm, IPC Medium Density; Manufacturer Part Number: BSS138LT1G; Pin Count: 3; Case: SOT23-3; Mounted: Yes; Socket: No; SMD: Yes; Sense: No; ComponentHeight: 1.11mm; HelpURL: \\cern.ch\dfs\Applications\Altium\Datasheets\BSS138LT1G.pdf; Author: CERN DEM JLC; CreateDate: 3/23/2009; LatestRevisionDate: 3/23/2009
T6 = IRLML6402PBF: P-CHANNEL MOSFET WITH ZENER DIODE; Part Description: -20V -3.7A P-Channel HEXFET® Power MOSFET; Manufacturer: INTERNATIONAL RECTIFIER; PressFit: No; Bonding: No; Part Number: IRLML6402PBF; Component Kind: Standard; Component Type: Standard; Device: IRLML6402PBF; PackageDescription: SOT, 0.95mm, pitch; 3 pin,1.30mm W X 2.92mm L X 1.12mm H body, IPC Medium Density; Manufacturer Part Number: IRLML6402PBF; Pin Count: 3; Case: SOT23-3; Mounted: Yes; Socket: No; SMD: Yes; Sense: No; ComponentHeight: 1.12mm; HelpURL: \\cern.ch\dfs\Applications\Altium\Datasheets\IRLML6402PBF.pdf; Author: CERN DEM JLC; CreateDate: 8/29/2011; LatestRevisionDate: 8/29/2011
TP3 TP4 = TP: Testpoint

## Sheet SFP.SchDoc
size A4; Organization: Altium Limited; Address1: L3, 12a Rodborough Rd; Address2: Frenchs Forest; Address3: NSW; Address4: Australia 2086
Used 6 times, as channels U_SFP, U_SFP, U_SFP, U_SFP, U_SFP, U_SFP. Parts and nets are listed once, with the designators drawn on the sheet.
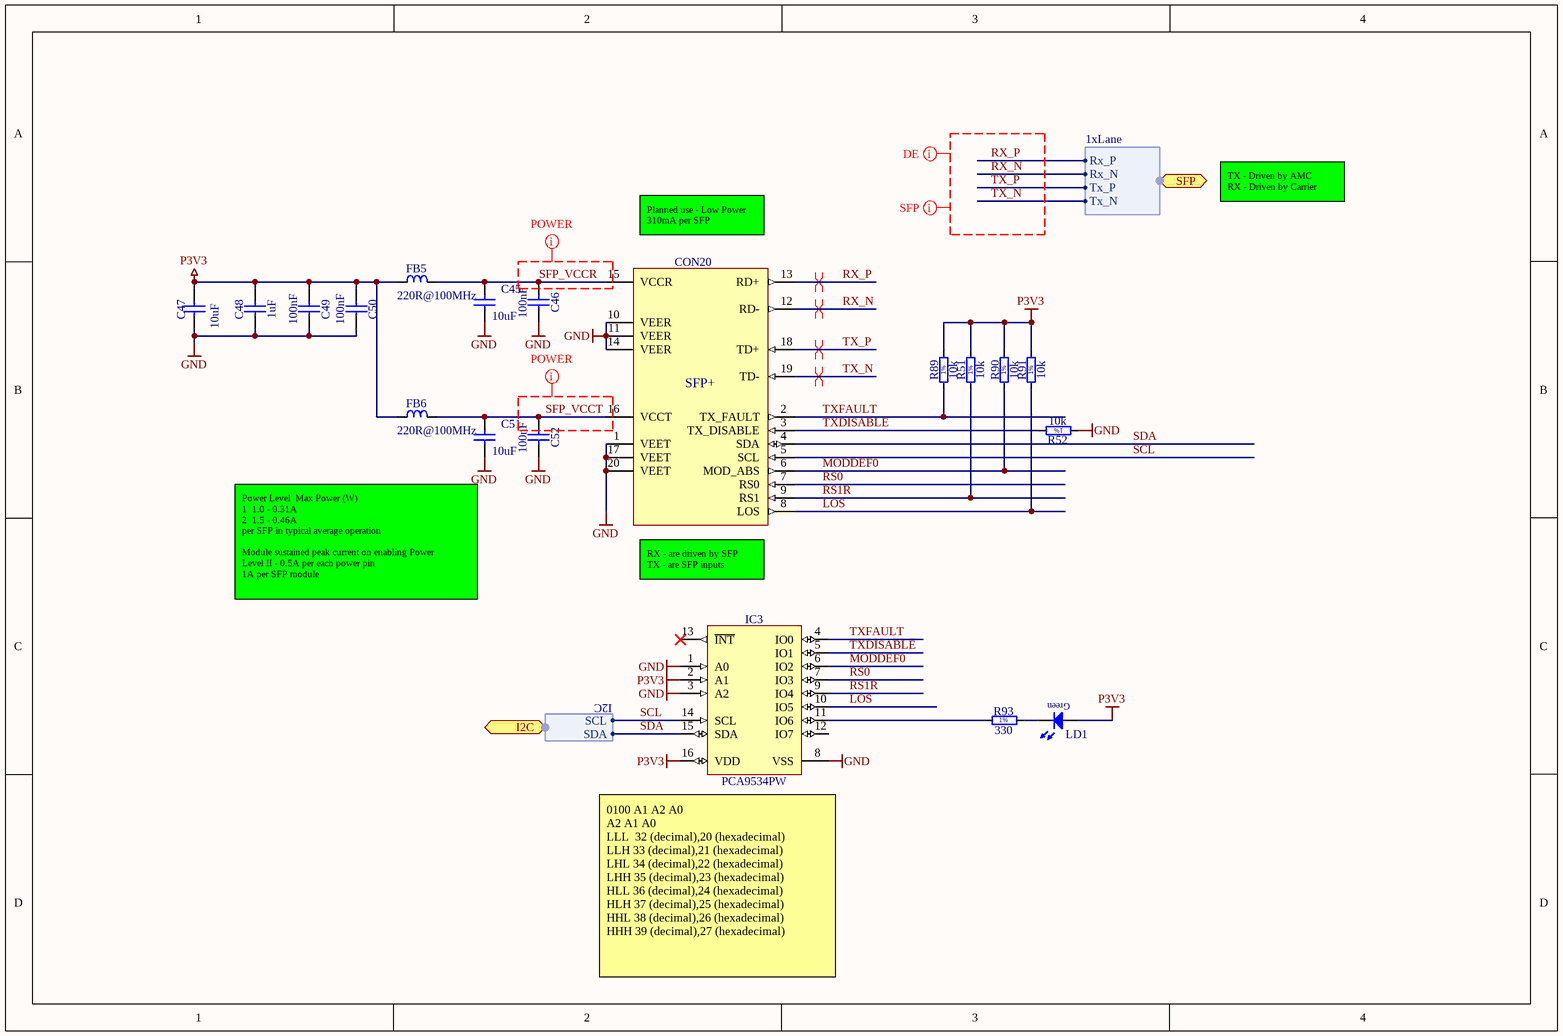
[diagram p2: SFP.SchDoc]

### Parts
C45  10uF  [CAPC2012X135N]
C46  100nF  [CAPC1005X55N]
C47  10uF  [CAPC2012X135N]
C48  1uF  [CAPC1608X87N]
C49  100nF  [CAPC1005X55N]
C50  100nF  [CAPC1005X55N]
C51  10uF  [CAPC2012X135N]
C52  100nF  [CAPC1005X55N]
CON20  1888247-1  [TYCO_1888247-1]  (value not drawn)
FB5  220R@100MHz  [INDC2012X105N]
FB6  220R@100MHz  [INDC2012X105N]
IC3  PCA9534PW  [SOP65P640X110-16N]
LD1  LED_AVAGO_HSME-C120  [LED_AVAGO_HSME-C120]  (value not drawn)
R51  10k  [RESC1005X40N]
R52  10k  [RESC1005X40N]
R89  10k  [RESC1005X40N]
R90  10k  [RESC1005X40N]
R91  10k  [RESC1005X40N]
R93  330  [RESC1608X55N]

### Ports
I2C (harness I2C), SFP (harness 1xLane)

### Harnesses
1xLane: Rx_P, Rx_N, Tx_P, Tx_N
I2C: SCL, SDA

### Nets
GND: C45.2 C46.2 C47.2 C48.1 C49.2 C50.2 C51.2 C52.2 CON20.1(VEET) CON20.10(VEER) CON20.11(VEER) CON20.14(VEER) CON20.17(VEET) CON20.20(VEET) IC3.1(A0) IC3.3(A2) IC3.8(VSS) R52.1
P3V3: C47.1 C48.2 C49.1 C50.1 FB5.1 FB6.1 IC3.2(A1) IC3.16(VDD) LD1.2(A) R51.2 R89.2 R90.2 R91.2
LOS: CON20.8(LOS) IC3.10(IO5) R91.1
MODDEF0: CON20.6(MOD_ABS) IC3.6(IO2) R90.1
RS0: CON20.7(RS0) IC3.7(IO3)
RS1R: CON20.9(RS1) IC3.9(IO4) R51.1
RX_N: CON20.12(RD-) ; port SFP.Rx_N
RX_P: CON20.13(RD+) ; port SFP.Rx_P
SCL: CON20.5(SCL) IC3.14(SCL) ; port I2C.SCL
SDA: CON20.4(SDA) IC3.15(SDA) ; port I2C.SDA
SFP_VCCR: C45.1 C46.1 CON20.15(VCCR) FB5.2
SFP_VCCT: C51.1 C52.1 CON20.16(VCCT) FB6.2
TX_N: CON20.19(TD-) ; port SFP.Tx_N
TX_P: CON20.18(TD+) ; port SFP.Tx_P
TXDISABLE: CON20.3(TX_DISABLE) IC3.5(IO1) R52.2
TXFAULT: CON20.2(TX_FAULT) IC3.4(IO0) R89.1
NetIC3_11: IC3.11(IO6) R93.1
NetLD1_1: LD1.1(C) R93.2

Not connected (* = marked no-connect by the designer): IC3 12(IO7) 13(~{INT})*

### Channels
U_SFP: designators end in A
U_SFP: designators end in B
U_SFP: designators end in C
U_SFP: designators end in D
U_SFP: designators end in E
U_SFP: designators end in F

### Layout directives
differential pair: QSFP_RX2_N, QSFP_RX2_P, QSFP_TX2_N, QSFP_TX2_P
net class POWER: SFP_VCCR, SFP_VCCT
net class SFP: RX_N, RX_P, TX_N, TX_P
net class DE: RX_N, RX_P, TX_N, TX_P

### Notes on the sheet
- (near CON20) Planned use - Low Power
  310mA per SFP
- TX - Driven by AMC
  RX - Driven by Carrier
- (near CON20) RX - are driven by SFP
  TX - are SFP inputs
- (near C51) Power Level  Max Power (W)
  1  1.0 - 0.31A
  2  1.5 - 0.46A
  per SFP in typical average operation
  Module sustained peak current on enabling Power
  Level II - 0.5A per each power pin
  1A per SFP module
- (near IC3) 0100 A1 A2 A0
  A2 A1 A0
  LLL 	32 (decimal),20 (hexadecimal)
  LLH	33 (decimal),21 (hexadecimal)
  LHL	34 (decimal),22 (hexadecimal)
  LHH	35 (decimal),23 (hexadecimal)
  HLL	36 (decimal),24 (hexadecimal)
  HLH	37 (decimal),25 (hexadecimal)
  HHL	38 (decimal),26 (hexadecimal)
  HHH	39 (decimal),27 (hexadecimal)
- (in symbol R0402_10K_1%_0.0625W_100PPM) 1%
- (in symbol R0603_330R_1%_0.1W_100PPM) 1%

### Library data of the parts
C45 C47 C51 = CC0805_10UF_10V_10%_X7R: as C10 on sheet Supply; Part Number: CC0805_10UF_10V_10%_X7R; Component Kind: Standard; Component Type: Standard; Pin Count: 2; Value: 10uF; Status: Preferred; Manufacturer Part Number: CC0805_10UF_10V_10%_X7R; Case: 0805; Mounted: Yes; Socket: No; SMD: Yes; Manufacturer1 Example: MURATA; Manufacturer1 ComponentHeight: 1.35mm; HelpURL: \\cern.ch\dfs\Applications\Altium\Datasheets\CC0805_X7R_MURATA.pdf; Author: CERN DEM JLC; CreateDate: 2012-04-30; LatestRevisionDate: 2012-04-30
C46 C49 C50 C52 = CC0402_100NF_16V_10%_X5R: Non-polarised capacitor; Part Description: SMD Multilayer Chip Ceramic Capacitor; Manufacturer: GENERIC; Manufacturer1 Part Number: GRM155R61C104KA88D; Voltage: 16V; TC: X5R; Tolerance: ±10%; Part Number: CC0402_100NF_16V_10%_X5R; Component Kind: Standard; Component Type: Standard; Pin Count: 2; Value: 100nF; Status: None; Manufacturer Part Number: CC0402_100NF_16V_10%_X5R; Case: 0402; Mounted: Yes; Socket: No; SMD: Yes; Manufacturer1 Example: MURATA; Manufacturer1 ComponentHeight: 0.55mm; HelpURL: \\cern.ch\dfs\Applications\Altium\Datasheets\CC0402_X5R_MURATA_GRM.pdf; Author: CERN DEM JLC; CreateDate: 10.12.2013; LatestRevisionDate: 10.12.2013; Sense: No
C48 = CC0603_1UF_25V_10%_X7R: Non-polarised capacitor; Part Description: SMD Multilayer Chip Ceramic Capacitor; Manufacturer: GENERIC; Manufacturer1 Part Number: GRM188R71E105KA12D; Voltage: 25V; TC: X7R; Tolerance: ±10%; Table: Capacitors SMD; Part Number: CC0603_1UF_25V_10%_X7R; Component Kind: Standard; Component Type: Standard; Pin Count: 2; Value: 1uF; Status: None; Manufacturer Part Number: CC0603_1UF_25V_10%_X7R; Case: 0603; Mounted: Yes; Socket: No; SMD: Yes; Manufacturer1 Example: MURATA; Manufacturer1 ComponentHeight: 0.9mm; HelpURL: \\cern.ch\dfs\Applications\Altium\Datasheets\CC0603_X7R_MURATA.pdf; Author: CERN DEM JLC; CreateDate: 2011-01-18; LatestRevisionDate: 2011-01-18
CON20 = TYCO_1888247-1: 20 Position SFP+ Connector (Small Form-factor Pluggable); Part Description: 20 Position, Pitch 0.8mm SFP+  Receptacle (Small Form-factor Pluggable); Manufacturer: TYCO ELECTRONICS; Table: TYCO; Part Number: TYCO_1888247-1; Component Kind: Standard; Component Type: Standard; Pin Count: 20; Family: SFP+; Mounted: Yes; Socket: No; SMD: Yes; Status: None; Manufacturer Part Number: 1888247-1; ComponentHeight: 5.4mm; HelpURL: \\cern.ch\dfs\Applications\Altium\Datasheets\TYCO_1888247-1.pdf; Author: CERN DEM JLC; CreateDate: 2012-02-27; LatestRevisionDate: 2012-02-27
FB5 FB6 = IND0805_MURATA_BLM21PG221SN1D: Inductor; Part Description: SMD EMIFIL Suppression Chip Ferrite Bead; Manufacturer: MURATA; Power: 2A; Resistance: 0.05R; Tolerance: ±25%; Table: Inductors SMD; Part Number: IND0805_MURATA_BLM21PG221SN1D; Component Kind: Standard; Component Type: Standard; Pin Count: 2; Value: 220R@100MHz; Status: None; Manufacturer Part Number: BLM21PG221SN1D; Case: 0805; Mounted: Yes; Socket: No; SMD: Yes; ComponentHeight: 1.05mm; HelpURL: \\cern.ch\dfs\Applications\Altium\Datasheets\IND0402_MURATA_BLM21P.pdf; Author: CERN DEM JLC; CreateDate: 2010-01-25; LatestRevisionDate: 2010-01-25
IC3 = PCA9534PW: 8-Bit I2C-Bus and SMBus Low Power I/O Port with Interrupt; Manufacturer: ANALOG DEVICES; PressFit: No; Bonding: No; Table: Analog & Interface; Part Number: PCA9534PW; Component Kind: Standard; Component Type: Standard; Device: PCA9534PW; PackageDescription: SOP, 0.65mm pitch; 16 pin, 4.40mm W X 5.00mm L X 1.10mm H body IPC Medium Density; Part Description: 8-Bit I2C-Bus and SMBus Low Power I/O Port with Interrupt; Manufacturer Part Number: PCA9534PW; Pin Count: 16; Case: SSOP16; Mounted: Yes; Socket: No; SMD: Yes; ComponentHeight: 1.1mm; Author: CERN DEM JLC; HelpURL: \\cern.ch\dfs\Applications\Altium\Datasheets\PCA9534PW.pdf; CreateDate: 2013-12-18; LatestRevisionDate: 2013-12-18
LD1 = LED_AVAGO_HSME-C120: LED Green 1C 2A; Part Description: High Performance Right Angle Chip Green LED; Manufacturer: AVAGO TECHNOLOGIES; Table: LEDs & Displays; Part Number: LED_AVAGO_HSME-C120; Component Kind: Standard; Component Type: Standard; Color: Green; PackageDescription: Green Chip LED, 2-Leads, Body 1.7x1.1mm, Side Emitting Package; Manufacturer Part Number: HSME-C120; Pin Count: 2; Mounted: Yes; Socket: No; SMD: Yes; ComponentHeight: 0.7mm; HelpURL: \\cern.ch\dfs\Applications\Altium\Datasheets\LED_AVAGO_HSME-C120.pdf; ComponentLink1URL: \\cern.ch\dfs\Applications\Altium\Datasheets\LED_AVAGO_HSME-C110_DESIGN-GUIDE.pdf; ComponentLink1Description: Design Guide; Author: CERN DEM JMW; CreateDate: 2009-07-22; LatestRevisionDate: 2012-06-20
R51 R52 R89-R91 = R0402_10K_1%_0.0625W_100PPM: as R23 on sheet Supply; Part Number: R0402_10K_1%_0.0625W_100PPM; Component Kind: Standard; Component Type: Standard; Pin Count: 2; Value: 10k; Status: Not recommended; Power: 0.0625W; Tolerance: ±1%; Manufacturer Part Number: R0402_10K_1%_0.0625W_100PPM; Case: 0402; Mounted: Yes; Socket: No; SMD: Yes; Manufacturer1 Example: YAGEO PHYCOMP; Manufacturer1 ComponentHeight: 0.4mm; HelpURL: \\cern.ch\dfs\Applications\Altium\Datasheets\R0402_Phycomp_RC0402.pdf; Author: CERN DEM JLC; CreateDate: 2007-12-03; LatestRevisionDate: 2012-10-17
R93 = R0603_330R_1%_0.1W_100PPM: Resistor - 1%; Part Description: General Purpose Thick Film Chip Resistor; Manufacturer: GENERIC; Manufacturer1 Part Number: NRC06F3300TRF; Power: 0.1W; TC: ±100ppm/°C; Table: Resistors SMD; Part Number: R0603_330R_1%_0.1W_100PPM; Component Kind: Standard; Component Type: Standard; Pin Count: 2; Value: 330; Status: Preferred; Tolerance: ±1%; Manufacturer Part Number: R0603_330R_1%_0.1W_100PPM; Case: 0603; Mounted: Yes; Socket: No; SMD: Yes; Manufacturer1 Example: NIC COMPONENT; Manufacturer1 ComponentHeight: 0.55mm; HelpURL: \\cern.ch\dfs\Applications\Altium\Datasheets\R0603_NIC_NRC.pdf; Author: CERN DEM JLC; CreateDate: 2007-12-03; LatestRevisionDate: 2008-03-13

## Sheet clocking.SchDoc
size A4
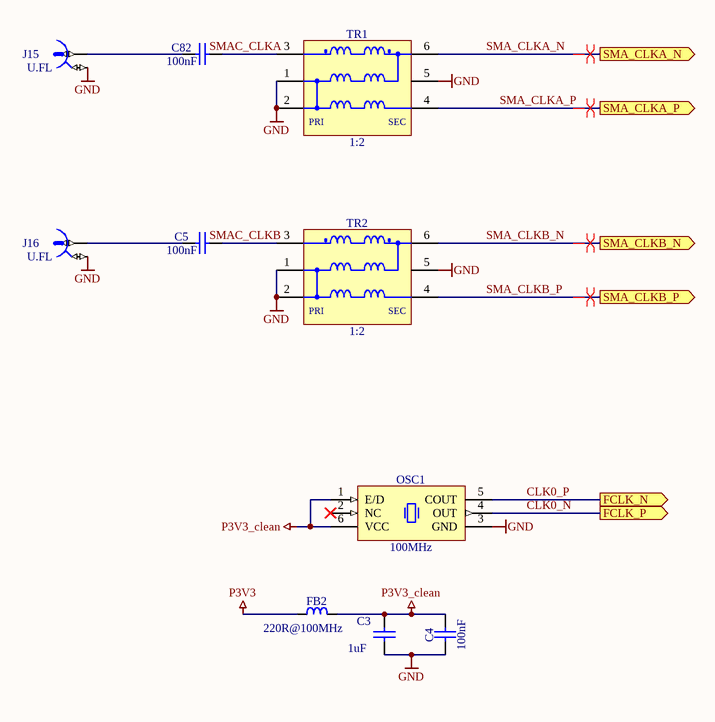
[diagram p3: clocking.SchDoc]

### Parts
C3  1uF  [CAPC1608X87N]
C4  100nF  [CAPC1005X55N]
C5  100nF  [CAPC1005X55N]
C82  100nF  [CAPC1005X55N]
FB2  220R@100MHz  [INDC2012X105N]
J15  U.FL  [HIROSE_U.FL-R-SMT-1(10)]
J16  U.FL  [HIROSE_U.FL-R-SMT-1(10)]
OSC1  100MHz  [OSC_CRYSTEK_CCLD-033]
TR1  1:2  [XFMR_MINI-CIRCUITS_DB1627]
TR2  1:2  [XFMR_MINI-CIRCUITS_DB1627]

### Ports
FCLK_N (out), FCLK_P (out), SMA_CLKA_N (out), SMA_CLKA_P (out), SMA_CLKB_N (out), SMA_CLKB_P (out)

### Nets
GND: C3.1 C4.1 J15.2 J16.2 OSC1.3(GND) TR1.1(P1) TR1.2(P1) TR1.5(NC) TR2.1(P1) TR2.2(P1) TR2.5(NC)
P3V3: FB2.1
P3V3_clean: C3.2 C4.2 FB2.2 OSC1.1(E/D) OSC1.6(VCC)
CLK0_N: OSC1.4(OUT) ; port FCLK_P
CLK0_P: OSC1.5(COUT) ; port FCLK_N
SMA_CLKA_N: TR1.6(S1) ; port SMA_CLKA_N
SMA_CLKA_P: TR1.4(S1) ; port SMA_CLKA_P
SMA_CLKB_N: TR2.6(S1) ; port SMA_CLKB_N
SMA_CLKB_P: TR2.4(S1) ; port SMA_CLKB_P
NetC5_1: C5.1 TR2.3(P1)
NetC5_2: C5.2 J16.1
NetC82_1: C82.1 TR1.3(P1)
NetC82_2: C82.2 J15.1

Not connected (* = marked no-connect by the designer): OSC1 2(NC)*

### Layout directives
differential pair: SMA_CLKA_N, SMA_CLKA_P, SMA_CLKB_N, SMA_CLKB_P

### Notes on the sheet
- Labels drawn without touching a wire or pin: SMAC_CLKA, SMAC_CLKB
- (in symbol XFMR_MINI-CIRCUITS_TCM2-43X+) PRI; SEC

### Library data of the parts
C3 = CC0603_1UF_25V_10%_X7R: as C48 on sheet SFP; Part Number: CC0603_1UF_25V_10%_X7R; Component Kind: Standard; Component Type: Standard; Pin Count: 2; Value: 1uF; Status: None; Manufacturer Part Number: CC0603_1UF_25V_10%_X7R; Case: 0603; Mounted: Yes; Socket: No; SMD: Yes; Manufacturer1 Example: MURATA; Manufacturer1 ComponentHeight: 0.9mm; HelpURL: \\cern.ch\dfs\Applications\Altium\Datasheets\CC0603_X7R_MURATA.pdf; Author: CERN DEM JLC; CreateDate: 2011-01-18; LatestRevisionDate: 2011-01-18
C4 = CC0402_100NF_16V_10%_X5R: as C46 on sheet SFP; Part Number: CC0402_100NF_16V_10%_X5R; Component Kind: Standard; Component Type: Standard; Pin Count: 2; Value: 100nF; Status: None; Manufacturer Part Number: CC0402_100NF_16V_10%_X5R; Case: 0402; Mounted: Yes; Socket: No; SMD: Yes; Manufacturer1 Example: MURATA; Manufacturer1 ComponentHeight: 0.55mm; HelpURL: \\cern.ch\dfs\Applications\Altium\Datasheets\CC0402_X5R_MURATA_GRM.pdf; Author: CERN DEM JLC; CreateDate: 10.12.2013; LatestRevisionDate: 10.12.2013; Sense: No
C5 C82 = CC0402_100NF_16V_10%_X5R: as C18 on sheet Supply; Part Number: CC0402_100NF_16V_10%_X5R; Component Kind: Standard; Component Type: Standard; Pin Count: 2; Value: 100nF; Status: None; Manufacturer Part Number: CC0402_100NF_16V_10%_X5R; Case: 0402; Mounted: Yes; Socket: No; SMD: Yes; Manufacturer1 Example: MURATA; Manufacturer1 ComponentHeight: 0.55mm; HelpURL: \\cern.ch\dfs\Applications\Altium\Datasheets\CC0402_X5R_MURATA_GRM.pdf; Author: CERN DEM JLC; CreateDate: 2013-12-10; LatestRevisionDate: 2013-12-10
FB2 = IND0805_MURATA_BLM21PG221SN1D: as FB5 on sheet SFP; Part Number: IND0805_MURATA_BLM21PG221SN1D; Component Kind: Standard; Component Type: Standard; Pin Count: 2; Value: 220R@100MHz; Status: None; Manufacturer Part Number: BLM21PG221SN1D; Case: 0805; Mounted: Yes; Socket: No; SMD: Yes; ComponentHeight: 1.05mm; HelpURL: \\cern.ch\dfs\Applications\Altium\Datasheets\IND0402_MURATA_BLM21P.pdf; Author: CERN DEM JLC; CreateDate: 2010-01-25; LatestRevisionDate: 2010-01-25
J15 J16 = HIROSE_U.FL-R-SMT-1(10): Part Description: Up to 6GHz Ultra Small Surface Mount Male Coaxial Connectors U.FL Series; Manufacturer: HIROSE (HRS); PressFit: No; Part Number: HIROSE_U.FL-R-SMT-1(10); Component Kind: Standard; Component Type: Standard; Pin Count: 2; Family: U.FL; Mounted: Yes; Socket: No; SMD: Yes; Sense: No; Status: None; Manufacturer Part Number: U.FL-R-SMT-1(10); ComponentHeight: 1.25mm; HelpURL: \\cern.ch\dfs\Applications\Altium\Datasheets\HIROSE_U.FL-R-SMT-1(10).pdf; Author: CERN DEM JLC; CreateDate: 24.03.2010; LatestRevisionDate: 24.03.2010
OSC1 = OSC_100MHZ_CRYSTEK_CCLD-033-50-100.000: 3.3V, ± 50ppm, 0°C to +70°C, Surface Mount LVDS Clock Oscillator (CCLD-033 Series); Manufacturer: CRYSTEK CRYSTAL; PressFit: No; Bonding: No; Part Number: OSC_100MHZ_CRYSTEK_CCLD-033-50-100.000; Component Kind: Standard; Component Type: Standard; PackageDescription: Oscillator, Side Concave, 2.54mm Pitch, 6 Pins, 5.00mm L X 7.00mm W X 1.80mm H, CCLD-033 Series; Value: 100MHz; Part Description: 3.3V, ± 50ppm, 0°C to +70°C, Surface Mount LVDS Clock Oscillator (CCLD-033 Series); Manufacturer Part Number: CCLD-033-50-100.000; Pin Count: 6; Mounted: Yes; Socket: No; SMD: Yes; Sense: No; ComponentHeight: 1.8mm; HelpURL: \\cern.ch\dfs\Applications\Altium\Datasheets\OSC_CRYSTEK_CCLD-033.pdf; Author: CERN DEM JLC; CreateDate: 23.02.2017; LatestRevisionDate: 23.02.2017
TR1 TR2 = XFMR_MINI-CIRCUITS_TCM2-43X+: 50 OHMS 10 to 4000 MHz RF Transformer; Power: 0.4W; Part Number: XFMR_MINI-CIRCUITS_TCM2-43X+; Component Kind: Standard; Component Type: Standard; Pin Count: 6; Value: 1:2; Status: None; Part Description: 50 Ohms 10 to 4000MHz RF Transformer; Manufacturer: MINI-CIRCUITS; Manufacturer Part Number: TCM2-43X+; Mounted: Yes; Socket: No; Sense: No; SMD: Yes; ComponentHeight: 4.06mm; HelpURL: \\cern.ch\dfs\Applications\Altium\Datasheets\XFMR_MINI-CIRCUITS_TCM2-43X+.pdf; Author: CERN DEM BC; CreateDate: 12.02.2016; LatestRevisionDate: 12.02.2016